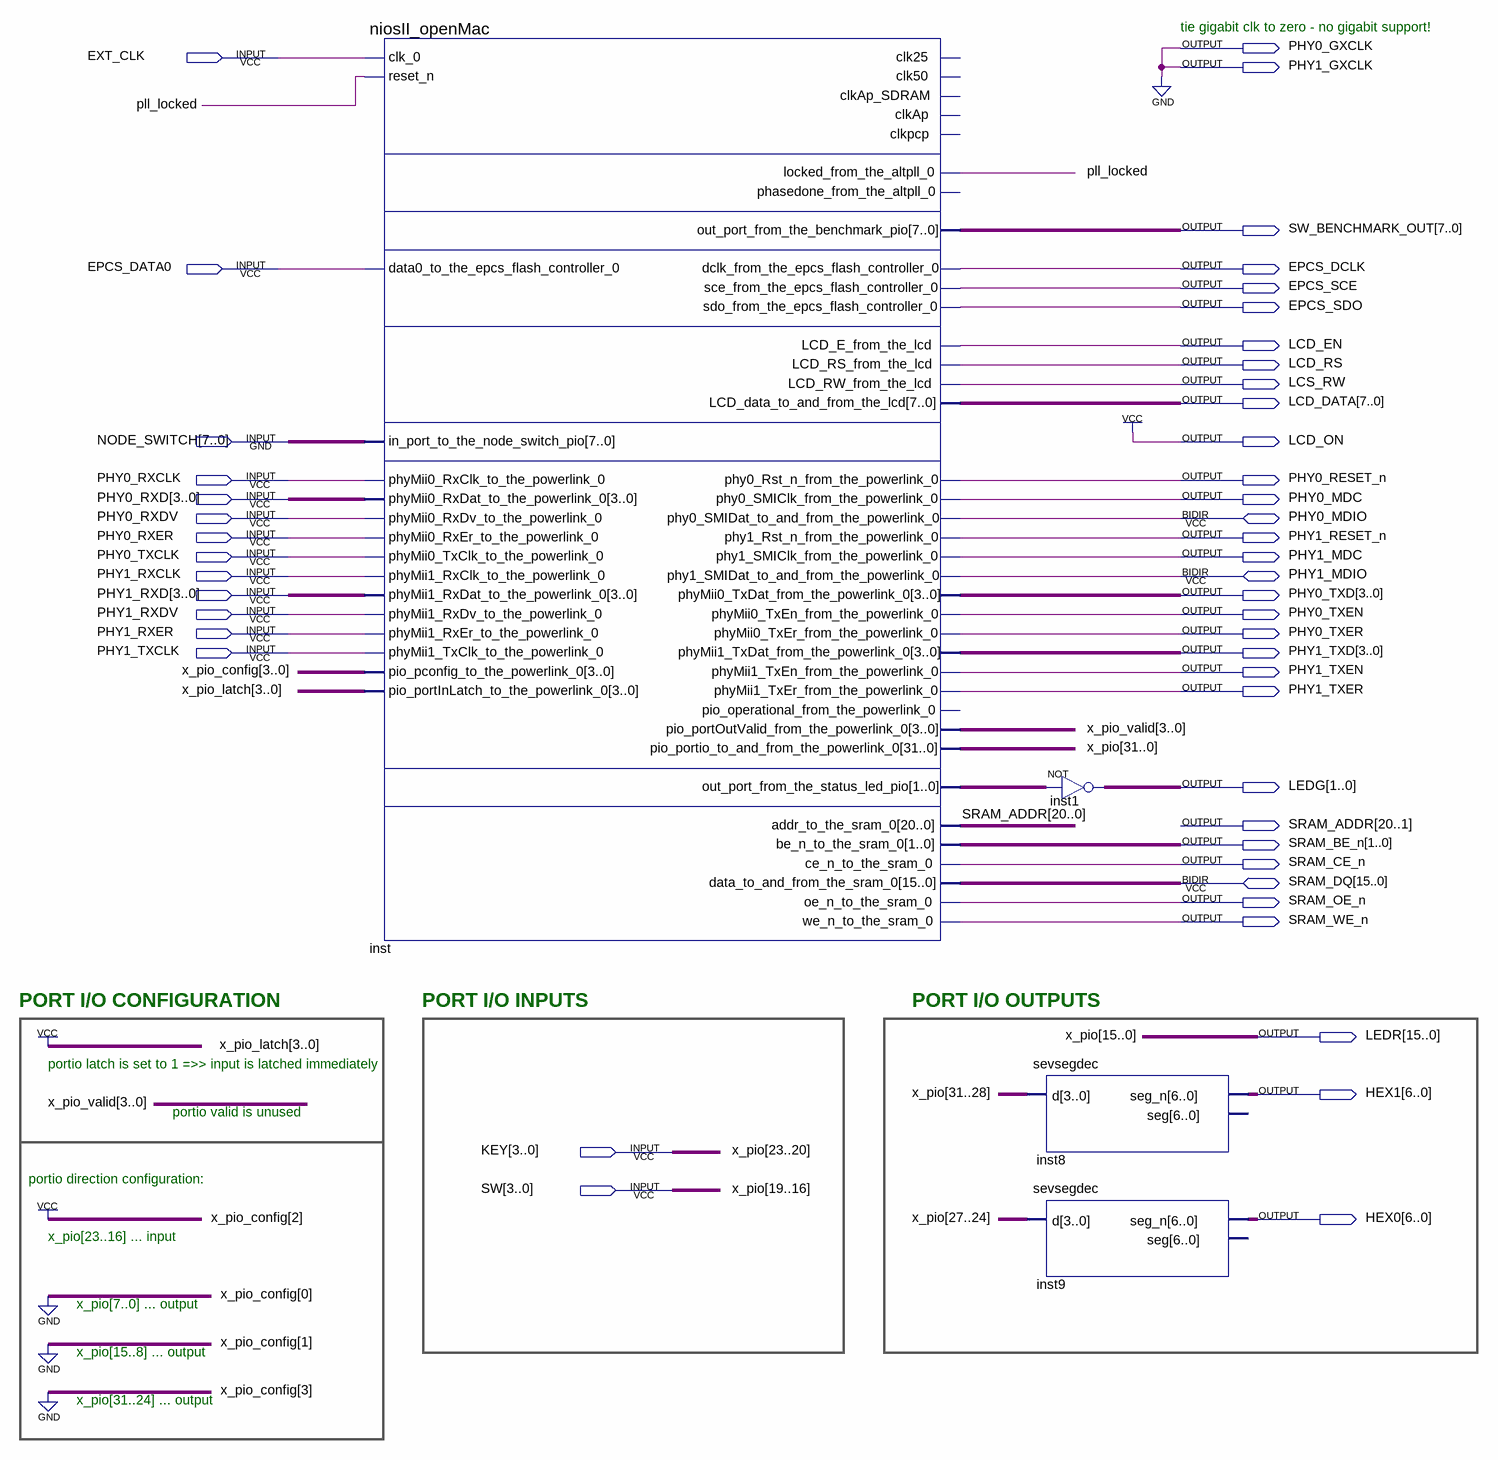
[diagram p0: schematic sheet]
// Quartus schematic nios_pll.bdf as structural Verilog: 4 symbols, 48 pins
module nios_pll (
  input  EXT_CLK,
  input  EPCS_DATA0,
  input  [7:0] NODE_SWITCH,
  input  PHY0_RXCLK,
  input  [3:0] PHY0_RXD,
  input  PHY0_RXDV,
  input  PHY0_RXER,
  input  PHY0_TXCLK,
  input  PHY1_RXCLK,
  input  [3:0] PHY1_RXD,
  input  PHY1_RXDV,
  input  PHY1_RXER,
  input  PHY1_TXCLK,
  input  [3:0] KEY,
  input  [3:0] SW,
  inout  PHY0_MDIO,
  inout  PHY1_MDIO,
  inout  [15:0] SRAM_DQ,
  output PHY0_GXCLK,
  output PHY1_GXCLK,
  output [7:0] SW_BENCHMARK_OUT,
  output EPCS_DCLK,
  output EPCS_SCE,
  output EPCS_SDO,
  output LCD_EN,
  output LCD_RS,
  output LCS_RW,
  output [7:0] LCD_DATA,
  output LCD_ON,
  output PHY0_RESET_n,
  output PHY0_MDC,
  output PHY1_RESET_n,
  output PHY1_MDC,
  output [3:0] PHY0_TXD,
  output PHY0_TXEN,
  output PHY0_TXER,
  output [3:0] PHY1_TXD,
  output PHY1_TXEN,
  output PHY1_TXER,
  output [1:0] LEDG,
  output [20:0] SRAM_ADDR,
  output [1:0] SRAM_BE_n,
  output SRAM_CE_n,
  output SRAM_OE_n,
  output SRAM_WE_n,
  output [15:0] LEDR,
  output [6:0] HEX1,
  output [6:0] HEX0
);

  wire pll_locked;
  wire [1:0] inst_out_port_from_the_status_led_pio;
  wire [3:0] x_pio_valid;
  wire [31:24] x_pio;

  niosII_openMac inst (
    .clk_0(EXT_CLK), .reset_n(pll_locked), .data0_to_the_epcs_flash_controller_0(EPCS_DATA0),
    .in_port_to_the_node_switch_pio(NODE_SWITCH), .phyMii0_RxClk_to_the_powerlink_0(PHY0_RXCLK),
    .phyMii0_RxDat_to_the_powerlink_0(PHY0_RXD), .phyMii0_RxDv_to_the_powerlink_0(PHY0_RXDV),
    .phyMii0_RxEr_to_the_powerlink_0(PHY0_RXER), .phyMii0_TxClk_to_the_powerlink_0(PHY0_TXCLK),
    .phyMii1_RxClk_to_the_powerlink_0(PHY1_RXCLK), .phyMii1_RxDat_to_the_powerlink_0(PHY1_RXD),
    .phyMii1_RxDv_to_the_powerlink_0(PHY1_RXDV), .phyMii1_RxEr_to_the_powerlink_0(PHY1_RXER),
    .phyMii1_TxClk_to_the_powerlink_0(PHY1_TXCLK), .pio_pconfig_to_the_powerlink_0(4'b0100),
    .pio_portInLatch_to_the_powerlink_0(4'b1111), .locked_from_the_altpll_0(pll_locked),
    .out_port_from_the_benchmark_pio(SW_BENCHMARK_OUT), .dclk_from_the_epcs_flash_controller_0(EPCS_DCLK),
    .sce_from_the_epcs_flash_controller_0(EPCS_SCE), .sdo_from_the_epcs_flash_controller_0(EPCS_SDO),
    .LCD_E_from_the_lcd(LCD_EN), .LCD_RS_from_the_lcd(LCD_RS), .LCD_RW_from_the_lcd(LCS_RW),
    .phy0_Rst_n_from_the_powerlink_0(PHY0_RESET_n), .phy0_SMIClk_from_the_powerlink_0(PHY0_MDC),
    .phy1_Rst_n_from_the_powerlink_0(PHY1_RESET_n), .phy1_SMIClk_from_the_powerlink_0(PHY1_MDC),
    .phyMii0_TxDat_from_the_powerlink_0(PHY0_TXD), .phyMii0_TxEn_from_the_powerlink_0(PHY0_TXEN),
    .phyMii0_TxEr_from_the_powerlink_0(PHY0_TXER), .phyMii1_TxDat_from_the_powerlink_0(PHY1_TXD),
    .phyMii1_TxEn_from_the_powerlink_0(PHY1_TXEN), .phyMii1_TxEr_from_the_powerlink_0(PHY1_TXER),
    .pio_portOutValid_from_the_powerlink_0(x_pio_valid),
    .out_port_from_the_status_led_pio(inst_out_port_from_the_status_led_pio), .addr_to_the_sram_0(SRAM_ADDR),
    .be_n_to_the_sram_0(SRAM_BE_n), .ce_n_to_the_sram_0(SRAM_CE_n), .oe_n_to_the_sram_0(SRAM_OE_n),
    .we_n_to_the_sram_0(SRAM_WE_n), .LCD_data_to_and_from_the_lcd(LCD_DATA),
    .phy0_SMIDat_to_and_from_the_powerlink_0(PHY0_MDIO), .phy1_SMIDat_to_and_from_the_powerlink_0(PHY1_MDIO),
    .pio_portio_to_and_from_the_powerlink_0({x_pio, KEY, SW, LEDR}), .data_to_and_from_the_sram_0(SRAM_DQ));  // open: clk25, clk50, clkAp_SDRAM, clkAp, clkpcp, phasedone_from_the_altpll_0, pio_operational_from_the_powerlink_0
  assign LEDG = ~inst_out_port_from_the_status_led_pio;  // NOT inst1, 2 bits wide
  sevsegdec inst8 (.d(x_pio[31:28]), .seg_n(HEX1));  // open: seg
  sevsegdec inst9 (.d(x_pio[27:24]), .seg_n(HEX0));  // open: seg

  assign LCD_ON = 1'b1;
  assign PHY0_GXCLK = 1'b0;
  assign PHY1_GXCLK = 1'b0;

  // Other names for the same wires on the sheet: x_pio[23:0] = {KEY, SW, LEDR}

  // Notes on the sheet:
  //   tie gigabit clk to zero - no gigabit support!
  //   PORT I/O CONFIGURATION
  //   PORT I/O INPUTS
  //   PORT I/O OUTPUTS
  //   portio latch is set to 1 =>> input is latched immediately
  //   portio valid is unused
  //   portio direction configuration:
  //   x_pio[23..16] ... input
  //   x_pio[7..0] ... output
  //   x_pio[15..8] ... output
  //   x_pio[31..24] ... output
endmodule
